# EAGLE design SystemControlCard (EAGLE 9.6.2)

## Sheet 1 of 2
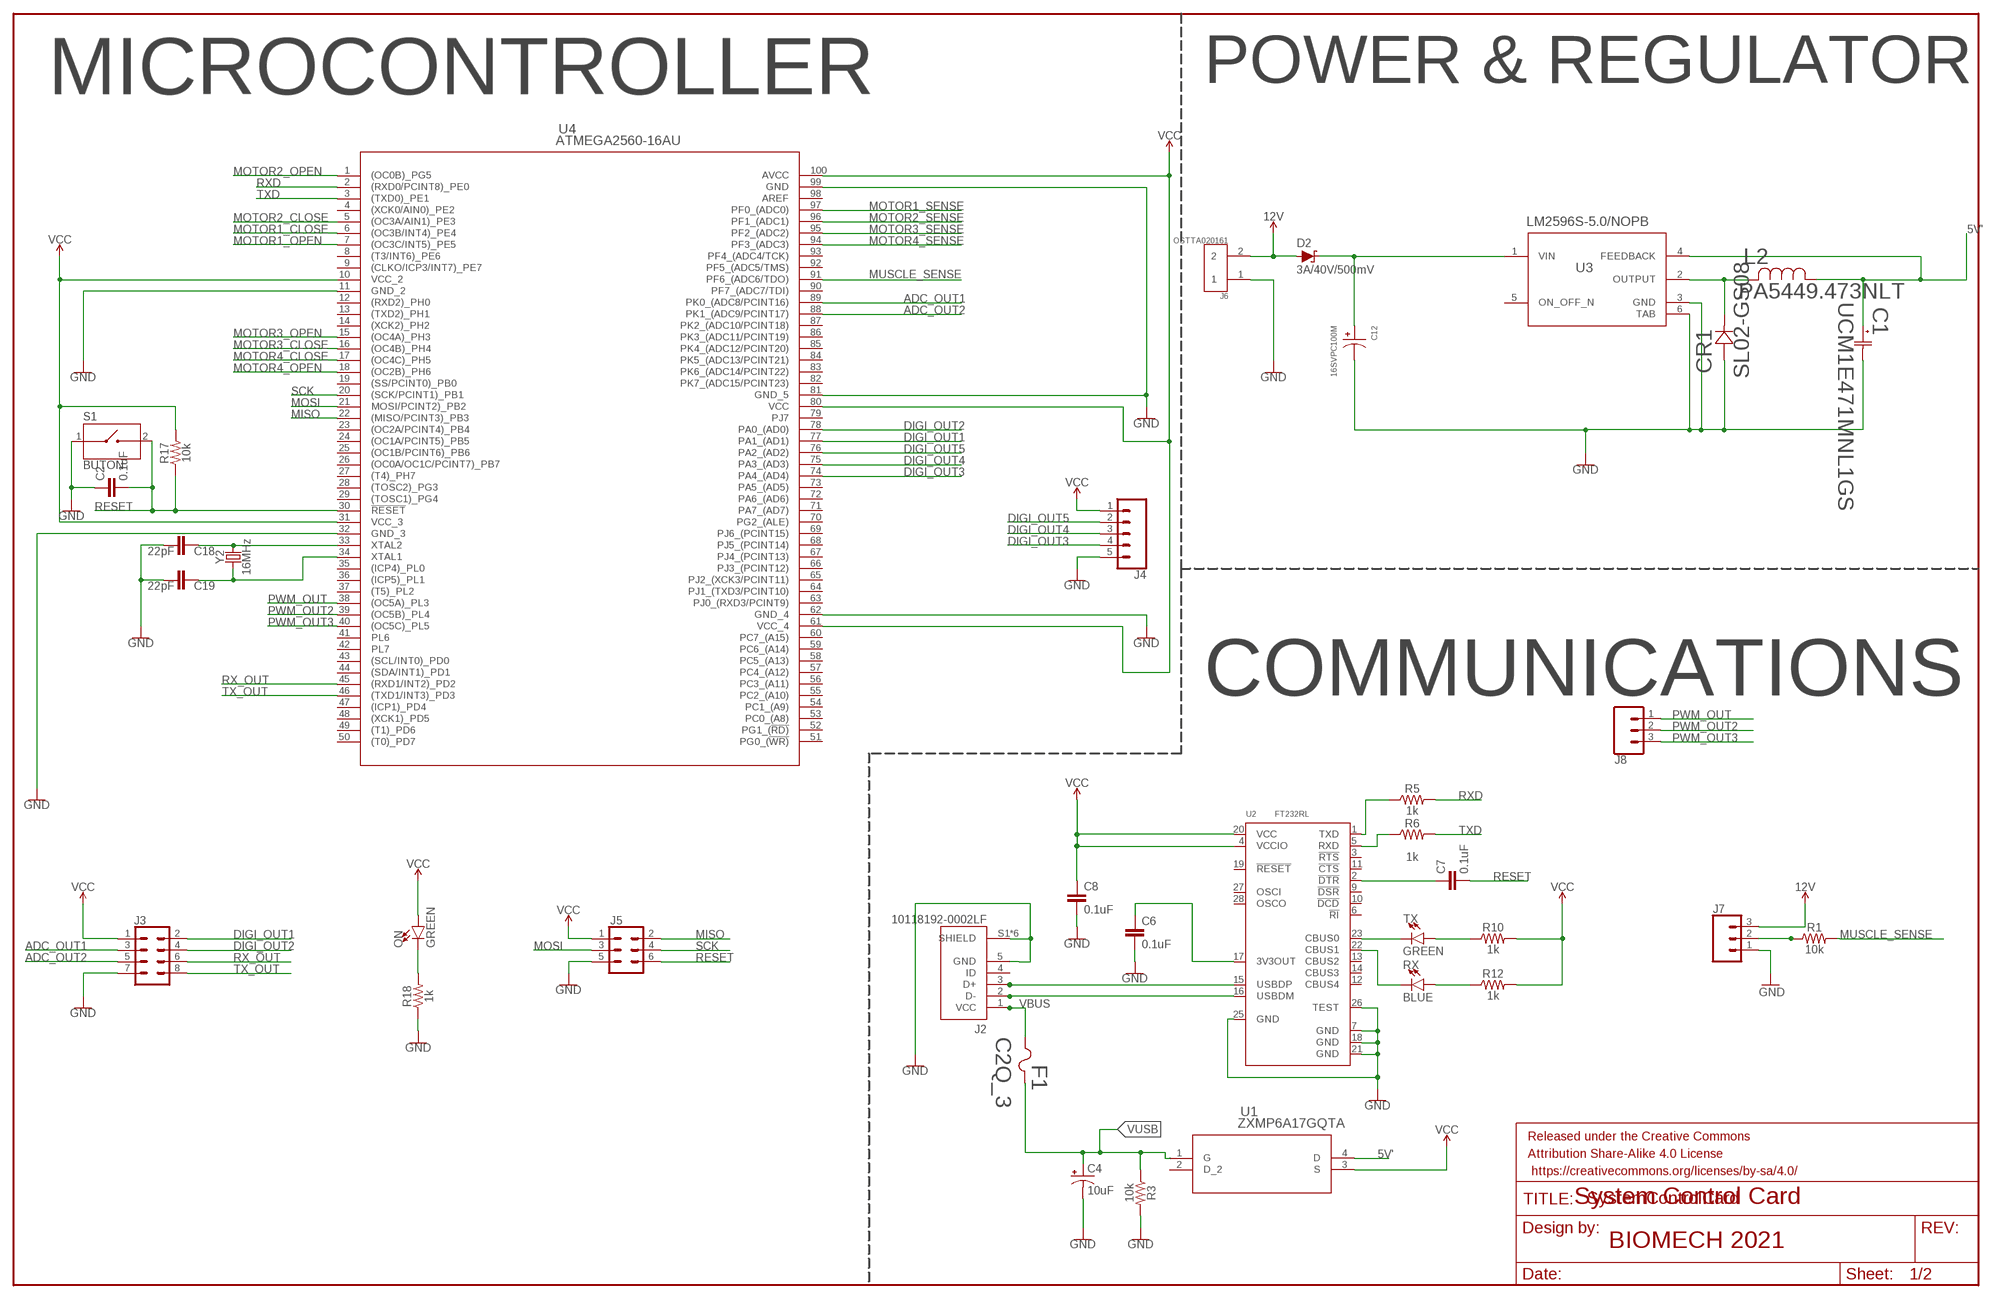
[diagram p0: schematic, sheet 1]

### Parts
C1  UCM1E471MNL1GS  [CAP_UCD_8X10_NCH]
C2  0.1uF  0.1UF-0603-25V-5%  [0603]
C4  10uF  10UF-POLAR-EIA3216-16V-10%(TANT)  [EIA3216]
C6  0.1uF  0.1UF-0603-25V-5%  [0603]
C7  0.1uF  0.1UF-0603-25V-5%  [0603]
C8  0.1uF  0.1UF-0603-25V-5%  [0603]
C12  16SVPC100M  [CAP_16SVPC100M]
C18  22pF  22PF-0603-50V-5%  [0603]
C19  22pF  22PF-0603-50V-5%  [0603]
CR1  SL02-GS08  [DIODE_SL02-GS08_VIS]
D2  3A/40V/500mV  DIODE-SCHOTTKY-B340A  [SMA-DIODE]
F1  C2Q_3  [C2_BEL]
FRAME2  FRAME-LEDGER  [CREATIVE_COMMONS]
J2  10118192-0002LF  [AMPHENOL_10118192-0002LF]
J3  CONN_04X2  [2X4]
J4  CONN_05NO_SILK  [1X05_NO_SILK]
J5  CONN_03X2NO_SILK  [2X3-NS]
J6  OSTTA020161  [OST_OSTTA020161]
J7  CONN_031X03_NO_SILK  [1X03_NO_SILK]
J8  CONN_031X03_NO_SILK  [1X03_NO_SILK]
L2  PA5449.473NLT  [IND_PA5449.473NLT_PUL]
ON  GREEN  LED-GREEN0603  [LED-0603]
R1  10k  10KOHM-0603-1/10W-1%  [0603]
R3  10k  10KOHM-0603-1/10W-1%  [0603]
R5  1k  1KOHM-0603-1/10W-1%  [0603]
R6  1k  1KOHM-0603-1/10W-1%  [0603]
R10  1k  1KOHM-0603-1/10W-1%  [0603]
R12  1k  1KOHM-0603-1/10W-1%  [0603]
R17  10k  10KOHM-0603-1/10W-1%  [0603]
R18  1k  1KOHM-0603-1/10W-1%  [0603]
RX  BLUE  LED-BLUE0603  [LED-0603]
S1  BUTON  1437566-4  [SW_1437566-4]
TX  GREEN  LED-GREEN0603  [LED-0603]
U1  ZXMP6A17GQTA  [SOT-223_DIO]
U2  FT232RL  INTERFACE-FT232RL(SSOP28)  [SSOP28-0.65-10.2X5.2MM]
U3  LM2596S-5.0/NOPB  [KTT0005B]
U4  ATMEGA2560-16AU  [100A_ATM]
Y2  16MHz  CRYSTAL-16MHZPTH-HC49US  [HC49US]

### Nets
5V': C1.1 L2.1 U1.4(D) U3.4(FEEDBACK)
12V: D2.A J6.2 J7.3 ; also sheet 2
ADC_OUT1: J3.3 U4.89(PK0_(ADC8/PCINT16))
ADC_OUT2: J3.5 U4.88(PK1_(ADC9/PCINT17))
DIGI_OUT1: J3.2 U4.77(PA1_(AD1))
DIGI_OUT2: J3.4 U4.78(PA0_(AD0))
DIGI_OUT3: J4.4 U4.74(PA4_(AD4))
DIGI_OUT4: J4.3 U4.75(PA3_(AD3))
DIGI_OUT5: J4.2 U4.76(PA2_(AD2))
GND: C1.2 C2.1 C4.- C6.2 C8.2 C12.2 C18.2 C19.2 CR1.2 J2.5(GND) J2.S1(SHIELD) J2.S2(SHIELD) J2.S3(SHIELD) J2.S4(SHIELD) J2.S5(SHIELD) J2.S6(SHIELD) J3.7 J4.5 J5.5 J6.1 J7.1 R3.2 R18.1 S1.1 U2.7(GND) U2.18(GND) U2.21(GND) U2.25(GND) U2.26(TEST) U3.3(GND) U3.6(TAB) U4.11(GND_2) U4.32(GND_3) U4.62(GND_4) U4.81(GND_5) U4.99(GND) ; also sheet 2
MISO: J5.2 U4.22((MISO/PCINT3)_PB3)
MOSI: J5.3 U4.21(MOSI/PCINT2)_PB2)
MOTOR1_CLOSE: U4.6((OC3B/INT4)_PE4) ; also sheet 2
MOTOR1_OPEN: U4.7((OC3C/INT5)_PE5) ; also sheet 2
MOTOR1_SENSE: U4.97(PF0_(ADC0)) ; also sheet 2
MOTOR2_CLOSE: U4.5((OC3A/AIN1)_PE3) ; also sheet 2
MOTOR2_OPEN: U4.1((OC0B)_PG5) ; also sheet 2
MOTOR2_SENSE: U4.96(PF1_(ADC1)) ; also sheet 2
MOTOR3_CLOSE: U4.16((OC4B)_PH4) ; also sheet 2
MOTOR3_OPEN: U4.15((OC4A)_PH3) ; also sheet 2
MOTOR3_SENSE: U4.95(PF2_(ADC2)) ; also sheet 2
MOTOR4_CLOSE: U4.17((OC4C)_PH5) ; also sheet 2
MOTOR4_OPEN: U4.18((OC2B)_PH6) ; also sheet 2
MOTOR4_SENSE: U4.94(PF3_(ADC3)) ; also sheet 2
MUSCLE_SENSE: R1.2 U4.91(PF6_(ADC6/TDO))
N$1: C12.1 D2.C U3.1(VIN)
N$2: J2.3(D+) U2.15(USBDP)
N$4: J2.2(D-) U2.16(USBDM)
N$5: R5.1 U2.1(TXD)
N$6: R6.1 U2.5(RXD)
N$7: C6.1 U2.17(3V3OUT)
N$9: TX.C U2.23(CBUS0)
N$10: RX.C U2.22(CBUS1)
N$11: J7.2 R1.1
N$12: R10.1 TX.A
N$13: R12.1 RX.A
N$14: C7.1 U2.2(!DTR)
N$18: CR1.1 L2.2 U3.2(OUTPUT)
N$40: ON.C R18.2
N$41: C18.1 U4.33(XTAL2) Y2.2
N$42: C19.1 U4.34(XTAL1) Y2.1
PWM_OUT: J8.1 U4.38((OC5A)_PL3)
PWM_OUT2: J8.2 U4.39((OC5B)_PL4)
PWM_OUT3: J8.3 U4.40((OC5C)_PL5)
RESET: C2.2 C7.2 J5.6 R17.1 S1.2 U4.30(!RESET)
RX_OUT: J3.6 U4.45((RXD1/INT2)_PD2)
RXD: R5.2 U4.2((RXD0/PCINT8)_PE0)
SCK: J5.4 U4.20((SCK/PCINT1)_PB1)
TX_OUT: J3.8 U4.46((TXD1/INT3)_PD3)
TXD: R6.2 U4.3((TXD0)_PE1)
VBUS: F1.1 J2.1(VCC)
VCC: C8.1 J3.1 J4.1 J5.1 ON.A R10.2 R12.2 R17.2 U1.3(S) U2.4(VCCIO) U2.20(VCC) U4.10(VCC_2) U4.31(VCC_3) U4.61(VCC_4) U4.80(VCC) U4.100(AVCC) ; also sheet 2
VUSB: C4.+ F1.2 R3.1 U1.1(G)
Unconnected: J2.4(ID) U1.2(D_2) U2.3(!RTS) U2.6(!RI) U2.9(!DSR) U2.10(!DCD) U2.11(!CTS) U2.12(CBUS4) U2.13(CBUS2) U2.14(CBUS3) U2.19(!RESET) U2.27(OSCI) U2.28(OSCO) U3.5(ON_OFF_N) U4.4((XCK0/AIN0)_PE2) U4.8((T3/INT6)_PE6) U4.9((CLKO/ICP3/INT7)_PE7) U4.12((RXD2)_PH0) U4.13((TXD2)_PH1) U4.14((XCK2)_PH2) U4.19((SS/PCINT0)_PB0) U4.23((OC2A/PCINT4)_PB4) U4.24((OC1A/PCINT5)_PB5) U4.25((OC1B/PCINT6)_PB6) U4.26((OC0A/OC1C/PCINT7)_PB7) U4.27((T4)_PH7) U4.28((TOSC2)_PG3) U4.29((TOSC1)_PG4) U4.35((ICP4)_PL0) U4.36((ICP5)_PL1) U4.37((T5)_PL2) U4.41(PL6) U4.42(PL7) U4.43((SCL/INT0)_PD0) U4.44((SDA/INT1)_PD1) U4.47((ICP1)_PD4) U4.48((XCK1)_PD5) U4.49((T1)_PD6) U4.50((T0)_PD7) U4.51(PG0_(!WR)) U4.52(PG1_(!RD)) U4.53(PC0_(A8)) U4.54(PC1_(A9)) U4.55(PC2_(A10)) U4.56(PC3_(A11)) U4.57(PC4_(A12)) U4.58(PC5_(A13)) U4.59(PC6_(A14)) U4.60(PC7_(A15)) U4.63(PJ0_(RXD3/PCINT9)) U4.64(PJ1_(TXD3/PCINT10)) U4.65(PJ2_(XCK3/PCINT11)) U4.66(PJ3_(PCINT12)) U4.67(PJ4_(PCINT13)) U4.68(PJ5_(PCINT14)) U4.69(PJ6_(PCINT15)) U4.70(PG2_(ALE)) U4.71(PA7_(AD7)) U4.72(PA6_(AD6)) U4.73(PA5_(AD5)) U4.79(PJ7) U4.82(PK7_(ADC15/PCINT23)) U4.83(PK6_(ADC14/PCINT22)) U4.84(PK5_(ADC13/PCINT21)) U4.85(PK4_(ADC12/PCINT20)) U4.86(PK3_(ADC11/PCINT19)) U4.87(PK2_(ADC10/PCINT18)) U4.90(PF7_(ADC7/TDI)) U4.92(PF5_(ADC5/TMS)) U4.93(PF4_(ADC4/TCK))

### Notes on the sheet
- MICROCONTROLLER | POWER & REGULATOR
- COMMUNICATIONS

## Sheet 2 of 2
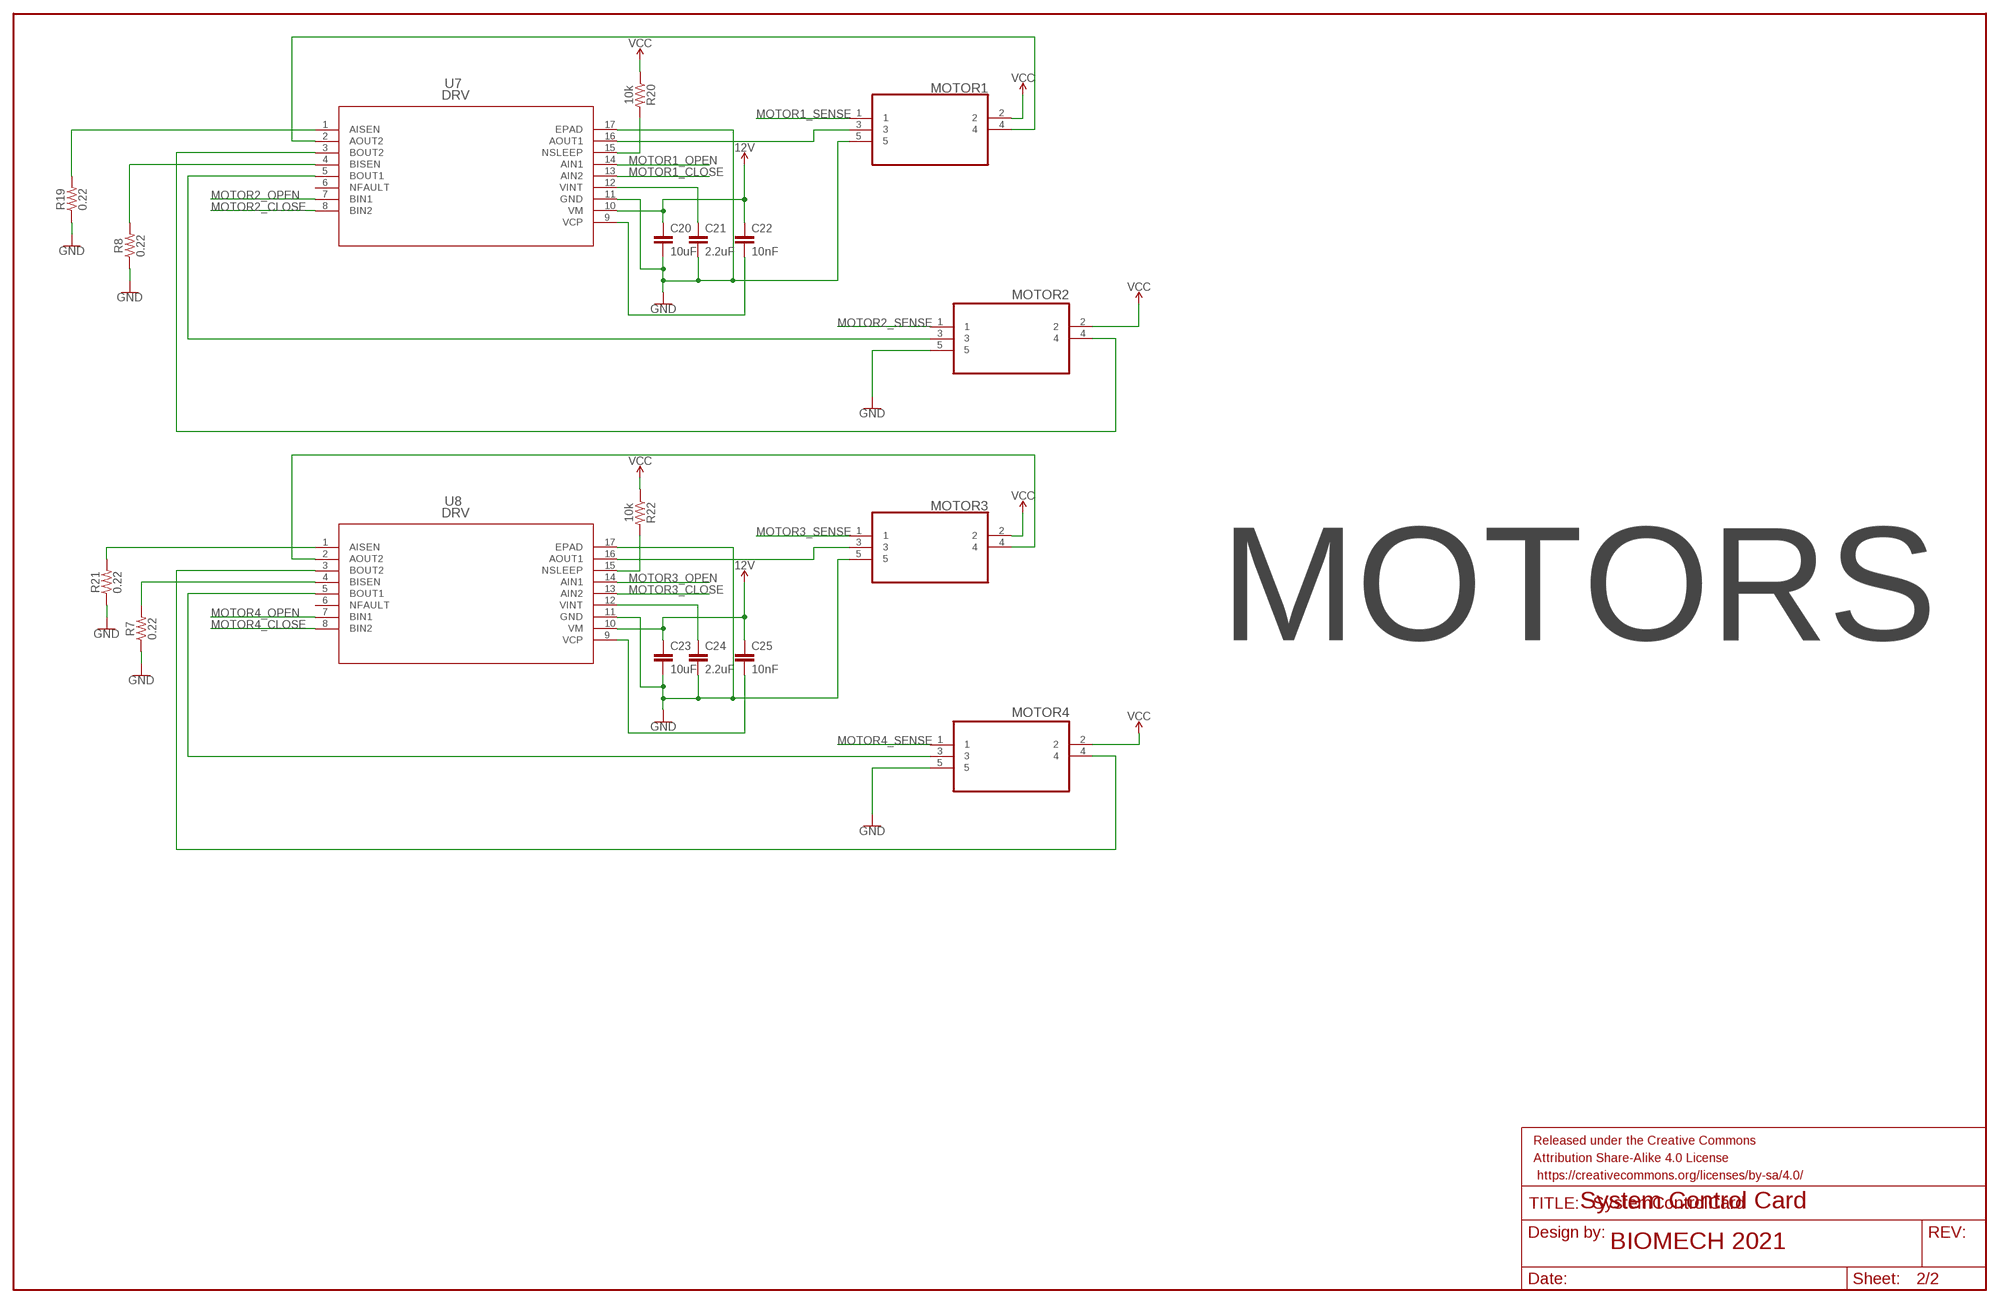
[diagram p1: schematic, sheet 2]

### Parts
C20  10uF  10UF-0603-6.3V-20%  [0603]
C21  2.2uF  2.2UF-0603-10V-20%  [0603]
C22  10nF  10NF-0603-50V-10%  [0603]
C23  10uF  10UF-0603-6.3V-20%  [0603]
C24  2.2uF  2.2UF-0603-10V-20%  [0603]
C25  10nF  10NF-0603-50V-10%  [0603]
FRAME1  FRAME-LEDGER  [CREATIVE_COMMONS]
MOTOR1  SFW5R-1STE1LF  [FCI_SFW5R-1STE1LF]
MOTOR2  SFW5R-1STE1LF  [FCI_SFW5R-1STE1LF]
MOTOR3  SFW5R-1STE1LF  [FCI_SFW5R-1STE1LF]
MOTOR4  SFW5R-1STE1LF  [FCI_SFW5R-1STE1LF]
R7  0.22  0.22OHM-0805-1/4W-1%  [0805]
R8  0.22  0.22OHM-0805-1/4W-1%  [0805]
R19  0.22  0.22OHM-0805-1/4W-1%  [0805]
R20  10k  10KOHM-0603-1/10W-1%  [0603]
R21  0.22  0.22OHM-0805-1/4W-1%  [0805]
R22  10k  10KOHM-0603-1/10W-1%  [0603]
U7  DRV  DRV8833RTYT  [RTY16]
U8  DRV  DRV8833RTYT  [RTY16]

### Nets
12V: C20.1 C22.1 C23.1 C25.1 U7.10(VM) U8.10(VM) ; also sheet 1
GND: C20.2 C21.2 C23.2 C24.2 MOTOR1.5 MOTOR2.5 MOTOR3.5 MOTOR4.5 R7.1 R8.1 R19.1 R21.1 U7.11(GND) U7.17(EPAD) U8.11(GND) U8.17(EPAD) ; also sheet 1
MOTOR1_CLOSE: U7.13(AIN2) ; also sheet 1
MOTOR1_OPEN: U7.14(AIN1) ; also sheet 1
MOTOR1_SENSE: MOTOR1.1 ; also sheet 1
MOTOR2_CLOSE: U7.8(BIN2) ; also sheet 1
MOTOR2_OPEN: U7.7(BIN1) ; also sheet 1
MOTOR2_SENSE: MOTOR2.1 ; also sheet 1
MOTOR3_CLOSE: U8.13(AIN2) ; also sheet 1
MOTOR3_OPEN: U8.14(AIN1) ; also sheet 1
MOTOR3_SENSE: MOTOR3.1 ; also sheet 1
MOTOR4_CLOSE: U8.8(BIN2) ; also sheet 1
MOTOR4_OPEN: U8.7(BIN1) ; also sheet 1
MOTOR4_SENSE: MOTOR4.1 ; also sheet 1
N$15: R7.2 U8.4(BISEN)
N$16: R8.2 U7.4(BISEN)
N$43: C22.2 U7.9(VCP)
N$44: R19.2 U7.1(AISEN)
N$45: C21.1 U7.12(VINT)
N$46: MOTOR2.3 U7.5(BOUT1)
N$47: MOTOR1.4 U7.2(AOUT2)
N$48: MOTOR2.4 U7.3(BOUT2)
N$49: MOTOR1.3 U7.16(AOUT1)
N$50: R20.2 U7.15(NSLEEP)
N$51: C25.2 U8.9(VCP)
N$52: R21.2 U8.1(AISEN)
N$53: C24.1 U8.12(VINT)
N$54: MOTOR4.3 U8.5(BOUT1)
N$55: MOTOR3.4 U8.2(AOUT2)
N$56: MOTOR4.4 U8.3(BOUT2)
N$57: MOTOR3.3 U8.16(AOUT1)
N$58: R22.2 U8.15(NSLEEP)
VCC: MOTOR1.2 MOTOR2.2 MOTOR3.2 MOTOR4.2 R20.1 R22.1 ; also sheet 1
Unconnected: U7.6(NFAULT) U8.6(NFAULT)

### Notes on the sheet
- MOTORS

## Power pins joined to a net without a drawn wire
AREF: U4.98(AREF)

## Library data of the parts
C1 = ucm-yenıkapasıtor:UCM1E471MNL1GS; COPYRIGHT: Copyright (C) 2021 Ultra Librarian. All rights reserved.; MANUFACTURER_PART_NUMBER: UCM1E471MNL1GS; MFR_NAME: Nichicon
C2 C6-C8 = SparkFun-Capacitors:0.1UF: 0.1µF ceramic capacitors A capacitor is a passive two-terminal electrical component used to store electrical energy temporarily in an electric field.; PROD_ID: CAP-08604
C4 = SparkFun-Capacitors:10UF-POLAR: 10.0µF polarized capacitors A capacitor is a passive two-terminal electrical component used to store electrical energy temporarily in an electric field.; PROD_ID: CAP-00811
C12 = 16SVPC100M:16SVPC100M: Check prices <https://pricing.snapeda.com/parts/16SVPC100M/Panasonic/view-part?ref=eda>; AVAILABILITY: In Stock; DESCRIPTION: 100µF 16V Aluminum - Polymer Capacitors Radial, Can - SMD 24mOhm 2000 Hrs @ 105°C; MF: Panasonic; MP: 16SVPC100M; PACKAGE: RADIAL-2 Panasonic; PRICE: None; PURCHASE-URL: https://pricing.snapeda.com/search/part/16SVPC100M/?ref=eda
C18 C19 = SparkFun-Capacitors:22PF: 22pF ceramic capacitors A capacitor is a passive two-terminal electrical component used to store electrical energy temporarily in an electric field.; PROD_ID: CAP-07876
C20 C23 = SparkFun-Capacitors:10UF: 10.0µF ceramic capacitors A capacitor is a passive two-terminal electrical component used to store electrical energy temporarily in an electric field.; PROD_ID: CAP-11015
C21 C24 = SparkFun-Capacitors:2.2UF: 2.2µF ceramic capacitors A capacitor is a passive two-terminal electrical component used to store electrical energy temporarily in an electric field.; PROD_ID: CAP-07888
C22 C25 = SparkFun-Capacitors:10NF: 0.01uF/10nF/10,000pF ceramic capacitors A capacitor is a passive two-terminal electrical component used to store electrical energy temporarily in an electric field. CAP-09321; PROD_ID: CAP-00867
CR1 = sl02 diodes:SL02-GS08; COPYRIGHT: Copyright (C) 2021 Ultra Librarian. All rights reserved.; MANUFACTURER_PART_NUMBER: SL02-GS08; MFR_NAME: Vishay
D2 = SparkFun-DiscreteSemi:DIODE-SCHOTTKY: Schottky diode A Schottky diode is a semiconductor diode which has a low forward voltage drop and a very fast switching action.; PROD_ID: DIO-09886
F1 = sigorta 603 paket:C2Q_3; COPYRIGHT: Copyright (C) 2021 Ultra Librarian. All rights reserved.; DIGI-KEY_PART_NUMBER_1: 507-1096-1-ND; DIGI-KEY_PART_NUMBER_2: 507-1096-2-ND; DIGI-KEY_PART_NUMBER_3: 507-1096-6-ND; MANUFACTURER_PART_NUMBER: C2Q 3; MFR_NAME: Belfuse
FRAME1 FRAME2 = SparkFun-Aesthetics:FRAME-LEDGER: Schematic Frame - Ledger Standard 11x14 US Ledger frame; DESIGNED_BY: BIOMECH 2021; TITLE: System Control Card
J2 = 10118192-0002LF:10118192-0002LF: USB - micro B USB 2.0 Receptacle Connector 5 Position Surface Mount, Right Angle Check prices <https://pricing.snapeda.com/parts/10118192-0002LF/Amphenol%20ICC/view-part?ref=eda>; AVAILABILITY: In Stock; DESCRIPTION: USB - micro B USB 2.0 Receptacle Connector 5 Position Surface Mount, Right Angle; MF: Amphenol ICC; MP: 10118192-0002LF; PACKAGE: None; PRICE: None; PURCHASE-URL: https://pricing.snapeda.com/search/part/10118192-0002LF/?ref=eda
J3 = SparkFun-Connectors:CONN_04X2: Multi connection point. Often used as Generic Header-pin footprint for 0.1 inch spaced/style header connections On any of the 0.1 inch spaced packages, you can populate with these: Break Away Headers - Straight <https://www.sparkfun.com/products/116> (PRT-00116) Break Away Male Headers - Right Angle <https://www.sparkfun.com/products/553> (PRT-00553) Female Headers <https://www.sparkfun.com/products/115> (PRT-00115) Break Away Headers - Machine Pin <https://www.sparkfun.com/products/117> (PRT-00117) Break Away Female Headers - Swiss Machine Pin <https://www.sparkfun.com/products/743> (PRT-00743)
J4 = SparkFun-Connectors:CONN_05: Multi connection point. Often used as Generic Header-pin footprint for 0.1 inch spaced/style header connections On any of the 0.1 inch spaced packages, you can populate with these: Break Away Headers - Straight <https://www.sparkfun.com/products/116> (PRT-00116) Break Away Male Headers - Right Angle <https://www.sparkfun.com/products/553> (PRT-00553) Female Headers <https://www.sparkfun.com/products/115> (PRT-00115) Break Away Headers - Machine Pin <https://www.sparkfun.com/products/117> (PRT-00117) Break Away Female Headers - Swiss Machine Pin <https://www.sparkfun.com/products/743> (PRT-00743) For SCREWTERMINALS and SPRING TERMINALS visit here: Screw Terimnals on SparkFun.com <https://www.sparkfun.com/search/results?term=Screw+Terminals> (5mm/3.5mm/2.54mm spacing) This device is also useful as a general connection point to wire up your design to another part of your project. Our various solder wires solder well into these plated through hole pads. Hook-Up Wire - Assortment (Stranded, 22 AWG) <https://www.sparkfun.com/products/11375> (PRT-11375) Hook-Up Wire - Assortment (Solid Core, 22 AWG) <https://www.sparkfun.com/products/11367> (PRT-11367) View the entire wire category on our website here <https://www.sparkfun.com/categories/141> Special notes: Molex polarized connector foot print use with SKU : PRT-08231 with associated crimp pins and housings. 1MM SMD Version SKU: PRT-10208
J5 = SparkFun-Connectors:CONN_03X2: Multi connection point. Often used as Generic Header-pin footprint for 0.1 inch spaced/style header connections You can populate with any combo of single row headers, but if you'd like an exact match, check these: Header - 2x3 (Male, 0.1") <https://www.sparkfun.com/products/12807> (PRT-12807) Header - 2x3 (Female, 0.1") <https://www.sparkfun.com/products/13010> (PRT-13010) 2x3 Pin Shrouded Header <https://www.sparkfun.com/products/10877> (PRT-10877) On any of the 0.1 inch spaced packages, you can populate with these: Break Away Headers - Straight <https://www.sparkfun.com/products/116> (PRT-00116) Break Away Male Headers - Right Angle <https://www.sparkfun.com/products/553> (PRT-00553) Female Headers <https://www.sparkfun.com/products/115> (PRT-00115) Break Away Headers - Machine Pin <https://www.sparkfun.com/products/117> (PRT-00117) Break Away Female Headers - Swiss Machine Pin <https://www.sparkfun.com/products/743> (PRT-00743) Special note: the shrouded connector mates well with our 3x2 ribbon cables: Ribbon Crimp Connector - 6-pin (2x3, Female) <https://www.sparkfun.com/products/10651> (PRT-10651) Ribbon Cable - 6 wire (15ft) <https://www.sparkfun.com/products/10646> (PRT-10646)
J6 = OSTTA020161:OSTTA020161: Connector Terminal Blocks 2 Position 5mm Solder Straight Thru-Hole 16A Check prices <https://pricing.snapeda.com/parts/OSTTA020161/On%20Shore%20Technology%20Inc./view-part?ref=eda>; AVAILABILITY: In Stock; DESCRIPTION: 2 Position Wire to Board Terminal Block Horizontal with Board 0.197 (5.00mm) Through Hole; MF: On Shore Technology Inc.; MP: OSTTA020161; PACKAGE: None; PRICE: None; PURCHASE-URL: https://pricing.snapeda.com/search/part/OSTTA020161/?ref=eda
J7 J8 = SparkFun-Connectors:CONN_03: Multi connection point. Often used as Generic Header-pin footprint for 0.1 inch spaced/style header connections On any of the 0.1 inch spaced packages, you can populate with these: Break Away Headers - Straight <https://www.sparkfun.com/products/116> (PRT-00116) Break Away Male Headers - Right Angle <https://www.sparkfun.com/products/553> (PRT-00553) Female Headers <https://www.sparkfun.com/products/115> (PRT-00115) Break Away Headers - Machine Pin <https://www.sparkfun.com/products/117> (PRT-00117) Break Away Female Headers - Swiss Machine Pin <https://www.sparkfun.com/products/743> (PRT-00743) Stackable Header - 3 Pin (Female, 0.1") <https://www.sparkfun.com/products/13875> (PRT-13875) For SCREWTERMINALS and SPRING TERMINALS visit here: Screw Terimnals on SparkFun.com <https://www.sparkfun.com/search/results?term=Screw+Terminals> (5mm/3.5mm/2.54mm spacing) This device is also useful as a general connection point to wire up your design to another part of your project. Our various solder wires solder well into these plated through hole pads. Hook-Up Wire - Assortment (Stranded, 22 AWG) <https://www.sparkfun.com/products/11375> (PRT-11375) Hook-Up Wire - Assortment (Solid Core, 22 AWG) <https://www.sparkfun.com/products/11367> (PRT-11367) View the entire wire category on our website here <https://www.sparkfun.com/categories/141> Special notes: Molex polarized connector foot print use with SKU : PRT-08232 with associated crimp pins and housings.
L2 = PA5449-INDUCTOR:PA5449.473NLT; COPYRIGHT: Copyright (C) 2021 Ultra Librarian. All rights reserved.; MANUFACTURER_PART_NUMBER: PA5449.473NLT; MFR_NAME: Pulse Electronics Corporation
MOTOR1-MOTOR4 = SFW5R-1STE1LF:SFW5R-1STE1LF: FFC/FPC CONNECTOR, RECEPTACLE, 5POS 1ROW Check prices <https://pricing.snapeda.com/parts/SFW5R-1STE1LF/Amphenol%20ICC/view-part?ref=eda>; AVAILABILITY: In Stock; DESCRIPTION: 5 Position FFC, FPC Connector Contacts, Bottom 0.039 (1.00mm) Surface Mount, Right Angle; MF: Amphenol ICC; MP: SFW5R-1STE1LF; PACKAGE: None; PRICE: None
ON TX = SparkFun-LED:LED-GREEN: Green SMD LED Used in manufacturing of various products at SparkFun Packages: 0603 - SMD 0603 package [Product Link] <http://www.futureelectronics.com/en/technologies/semiconductors/optoelectronics/leds/Pages/9894312-LTST-C190GKT.aspx?CrossPart=HSMG-C190&IM=0> LilyPad 1206 - SMD1206 LilyPad package [Product Link] <http://www.futureelectronics.com/en/Technologies/Product.aspx?ProductID=IN150NGHARVATEKCORPORATION2049943&IM=0> 1206 - SMD1206 package [Product Link] <http://www.futureelectronics.com/en/technologies/semiconductors/optoelectronics/leds/Pages/8315665-LTST-C150KGKT.aspx?IM=0> 1206 Bottom Mount -SMD 1206 Bottom Mount [Product Link] <http://www.digikey.com/product-detail/en/lite-on-inc/LTST-C230KGKT/160-1456-1-ND/386854> SparkFun Products: Pro Mini 328 -5V <https://www.sparkfun.com/products/821> RedBoard <https://www.sparkfun.com/products/12757> MP3 Trigger <https://www.sparkfun.com/products/13720> Makey Makey <https://www.sparkfun.com/products/11076>; PROD_ID: DIO-00821
R1 R3 R17 R20 R22 = SparkFun-Resistors:10KOHM: 10kΩ resistor A resistor is a passive two-terminal electrical component that implements electrical resistance as a circuit element. Resistors act to reduce current flow, and, at the same time, act to lower voltage levels within circuits. - Wikipedia; PROD_ID: RES-00824
R5 R6 R10 R12 R18 = SparkFun-Resistors:1KOHM: 1kΩ resistor A resistor is a passive two-terminal electrical component that implements electrical resistance as a circuit element. Resistors act to reduce current flow, and, at the same time, act to lower voltage levels within circuits. - Wikipedia; PROD_ID: RES-07856
R7 R8 R19 R21 = SparkFun-Resistors:0.22OHM: 0.22Ω resistor A resistor is a passive two-terminal electrical component that implements electrical resistance as a circuit element. Resistors act to reduce current flow, and, at the same time, act to lower voltage levels within circuits. - Wikipedia; PROD_ID: RES-09883
RX = SparkFun-LED:LED-BLUE: Blue SMD LED Used in manufacturing of various products at SparkFun Packages: 0603 - SMD 0603 package [Product Link] <http://www.digikey.com/product-detail/en/SMLE12BC7TT86/511-1589-2-ND/1641808> 1206 - SMD1206 package [Product Link] <http://www.digikey.com/product-detail/en/lite-on-inc/LTST-C150TBKT/160-1643-1-ND/573584> SparkFun Products: ESP8266 Thing-Dev Board <https://www.sparkfun.com/products/13711> RedBoard <https://www.sparkfun.com/products/12757>; PROD_ID: DIO-08575
S1 = 1437566-4:1437566-4: SWITCH TACTILE SPST-NO 0.05A 24V Check prices <https://pricing.snapeda.com/parts/FSMSMTR/TE%20Connectivity/view-part?ref=eda>; AVAILABILITY: In Stock; COMMENT: 1437566-4; CONFIGURATION_POLE-THROW: Single Pole - Single Throw; CONTACT_CURRENT_RATING: 50 mA; DESCRIPTION: Switch Tactile OFF (ON) SPST Rectangular Button Gull Wing 0.05A 12VDC 1.77N SMD T/R; MF: TE Connectivity; MP: FSMSMTR; PACKAGE: None; PRICE: None; PURCHASE-URL: https://pricing.snapeda.com/search/part/FSMSMTR/?ref=eda
U1 = mosfet:ZXMP6A17GQTA; COPYRIGHT: Copyright (C) 2021 Ultra Librarian. All rights reserved.; DIGI-KEY_PART_NUMBER_1: ZXMP6A17GQTADICT-ND; DIGI-KEY_PART_NUMBER_2: ZXMP6A17GQTADIDKR-ND; DIGI-KEY_PART_NUMBER_3: ZXMP6A17GQTADITR-ND; MANUFACTURER_PART_NUMBER: ZXMP6A17GQTA; MFR_NAME: Diodes Inc
U2 = INTERFACE-FT232RL_SSOP28_:INTERFACE-FT232RL(SSOP28): 310070022 Check prices <https://pricing.snapeda.com/parts/FT232RL/FTDI%2C%20Future/view-part?ref=eda>; AVAILABILITY: No availability data; DESCRIPTION: USB Bridge, USB to UART USB 2.0 UART Interface 28-SSOP; MF: FTDI, Future; MP: FT232RL; PACKAGE: SSOP-28 FTDI; PRICE: None
U3 = lm2596s-5v:LM2596S-5.0/NOPB; COPYRIGHT: Copyright (C) 2021 Ultra Librarian. All rights reserved.; MANUFACTURER_PART_NUMBER: LM2596S-5.0/NOPB; MFR_NAME: Texas Instruments; REFDES: RefDes; TYPE: TYPE
U4 = ATMEGA 2560:ATMEGA2560-16AU; BUILT_BY: EMA_UL_Team; MANUFACTURER_PART_NUMBER: ATMEGA2560-16AU; SOURCELIBRARY: Atmel_2011-04-02; VENDOR: Atmel
U7 U8 = DRV8833:DRV8833RTYT; DATASHEET_URL: http://www.ti.com/lit/gpn/DRV8833; DESCRIPTION: 2A Low Voltage Dual Brushed DC or Single Bipolar Stepper Motor Driver (PWM Ctrl); FAMILY_NAME: BRUSHED DC DRIVER; GENERIC_PART_NUMBER: DRV8833; INDUSTRY_STD_PKG_TYPE: QFN; MANUFACTURER: Texas Instruments; MANUFACTURER_PART_NUMBER: DRV8833RTYT; PACKAGE_DESIGNATOR: RTY; PIN_COUNT: 16; VENDOR: Texas Instruments
Y2 = SparkFun-Clocks:CRYSTAL-16MHZ: 16MHz Crystal Digikey Example <http://www.digikey.com/product-search/en?keywords=535-9122-1-ND> Frequency: 16MHz Frequency Stability: ±50ppm Frequency Tolerance: ±20ppm Load Capacitance: 18pF SparkFun Products: Pro Micro -5V/16MHz <https://www.sparkfun.com/products/12640> SparkFun Serial Enabled LCD Kit <https://www.sparkfun.com/products/10097>; PROD_ID: XTAL-08181; SF_ID: COM-00536

## Board
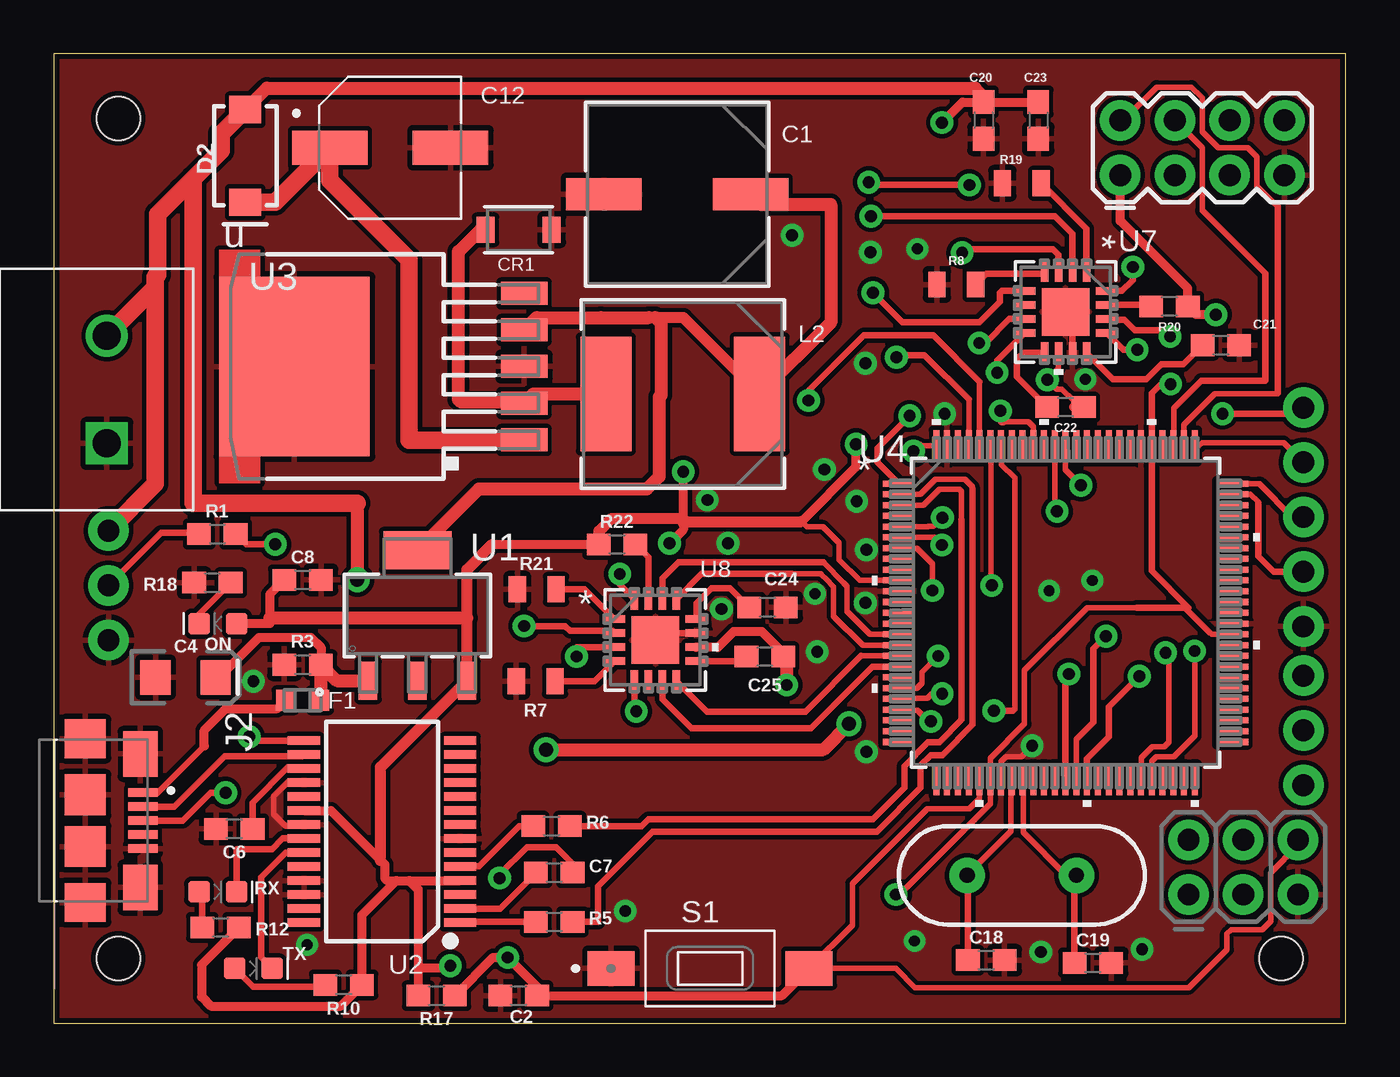
[diagram p2: board, top side]
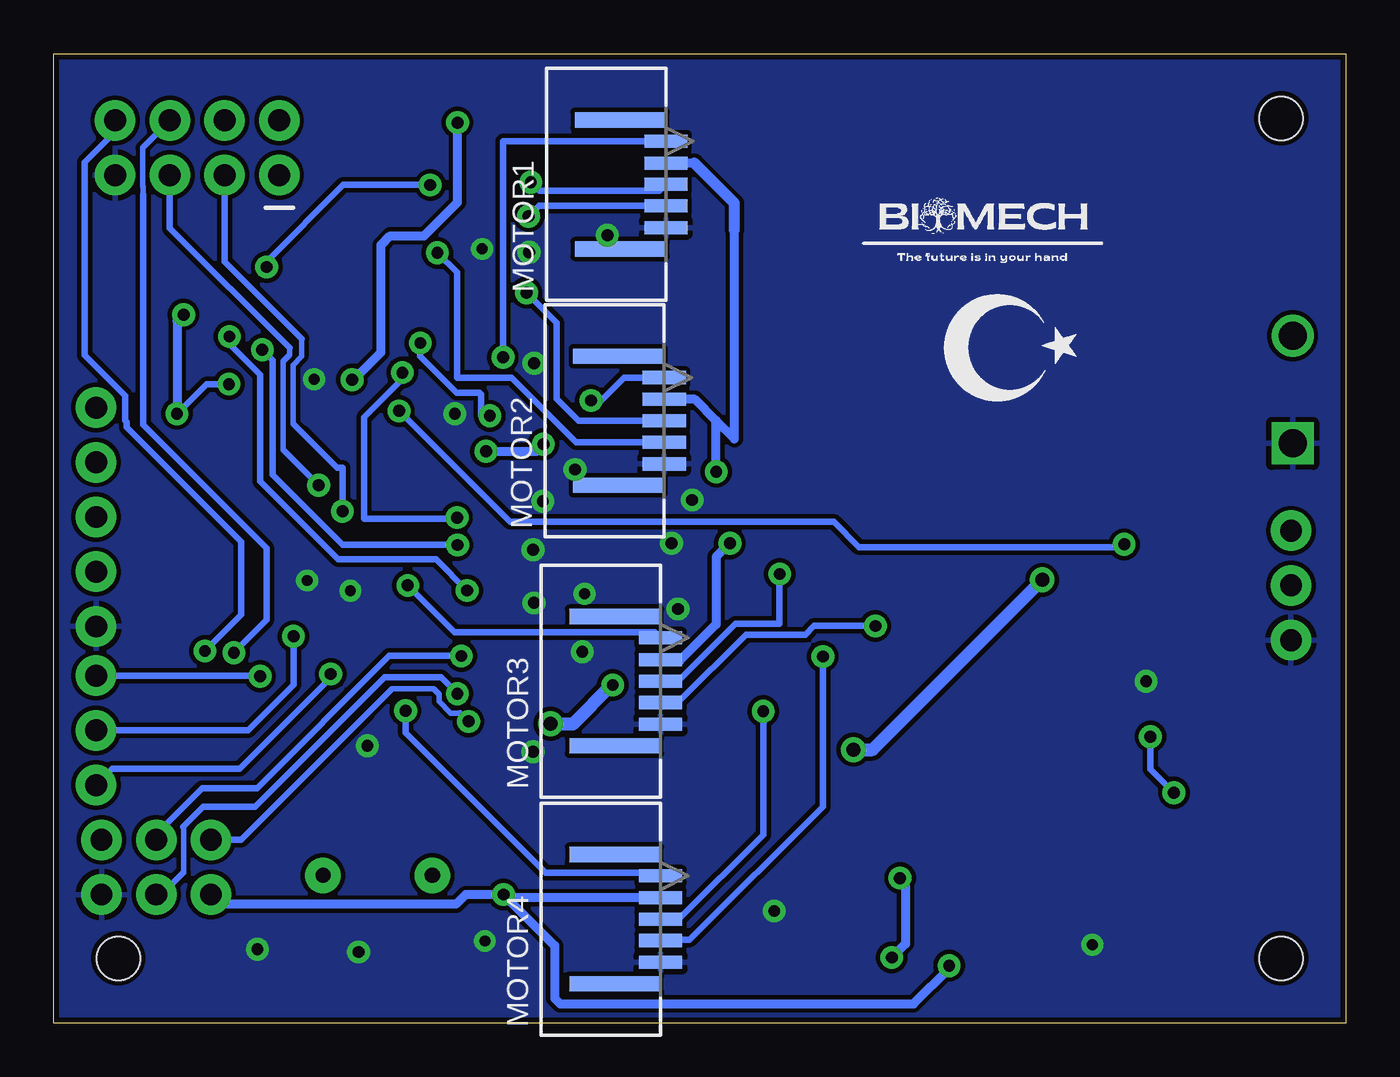
[diagram p3: board, bottom side, seen from below]

Size 60 x 45 mm. Coordinates in mm from the lower left corner, seen from the top.
Outline: 0,0 60,0 60,45 0,45 0,0
Copper layers (1*16): Top 0.035mm / dielectric 1.5mm / Bottom 0.035mm
Design rules "SparkFun_1": minimum track width 8mil, minimum drill 20mil, track to track 8mil, track to pad 8mil, pad to pad 8mil, via to via 8mil, smd to smd 8mil, copper to edge 10mil, drill to drill 8mil, minimum pad ring 12mil, minimum via ring 10mil, stop-mask expansion 4mil, vias tented up to drill 25mil, thermal gap 10mil
Holes 2 mm at 3,42 3,3 57,3

### Footprints (pad centres in the part's own frame; a part is rotated, then mirrored left to right if it is on the bottom)
CAP_UCD_8X10_NCH = smd 3.505 x 1.499: 1 -3.404,0; 2 3.404,0
0603 = smd 1.1 x 1: 1 -0.85,0; 2 0.85,0
EIA3216 = smd 1.4 x 1.6: + 1.4,0; - -1.4,0
CAP_16SVPC100M = smd 3.5 x 1.6: 1 -2.8,0; 2 2.8,0
DIODE_SL02-GS08_VIS = smd 0.838 x 1.194: 1 -1.537,0; 2 1.537,0
SMA-DIODE = smd 1.27 x 1.47: A -2.15,0; C 2.15,0
C2_BEL = smd 0.864 x 0.965: 1 -0.8,0; 2 0.8,0
AMPHENOL_10118192-0002LF = smd 0.4 x 1.35: 1 -1.3,0; 2 -0.65,0; 3 0,0; 4 0.65,0; 5 1.3,0 | smd 2.1 x 1.6: S1 -3.1,-0.125; S2 3.1,-0.125 | smd 1.8 x 1.9: S3 -3.8,-2.675; S6 3.8,-2.675 | smd 1.9 x 1.9: S4 -1.2,-2.675; S5 1.2,-2.675
2X4 = drill 1.016 pad 1.88: 1 -3.81,-1.27; 2 -3.81,1.27; 3 -1.27,-1.27; 4 -1.27,1.27; 5 1.27,-1.27; 6 1.27,1.27; 7 3.81,-1.27; 8 3.81,1.27
1X05_NO_SILK = drill 1.016 pad 1.88: 1 0,0; 2 2.54,0; 3 5.08,0; 4 7.62,0; 5 10.16,0
2X3-NS = drill 1.016 pad 1.88: 1 -2.54,-1.27; 2 -2.54,1.27; 3 0,-1.27; 4 0,1.27; 5 2.54,-1.27; 6 2.54,1.27
OST_OSTTA020161 = drill 1.3 square: 1 -2.5,0 | drill 1.3: 2 2.5,0
1X03_NO_SILK = drill 1.016 pad 1.88: 1 0,0; 2 2.54,0; 3 5.08,0
IND_PA5449.473NLT_PUL = smd 2.362 x 5.309: 1 -3.569,0; 2 3.569,0
FCI_SFW5R-1STE1LF = smd 0.61 x 2.007: 1 2.007,2.743; 2 0.991,2.743; 3 0,2.743; 4 -0.991,2.743; 5 -2.007,2.743 | smd 0.711 x 4.191: 6 -2.997,4.877; 7 2.997,4.877
LED-0603 = smd 1 x 1: A -0.877,0; C 0.877,0
0805 = smd 0.8 x 1.2: 1 -0.9,0; 2 0.9,0
SW_1437566-4 = smd 2.18 x 1.6: 1 -4.6,0; 2 4.6,0
SOT-223_DIO = smd 0.851 x 1.761: 1 -2.3,-3.025; 2 0,-3.025; 3 2.3,-3.025 | smd 3.151 x 1.761: 4 0,3.025
SSOP28-0.65-10.2X5.2MM = smd 0.4 x 1.5: 1 -4.225,-3.625; 2 -3.575,-3.625; 3 -2.925,-3.625; 4 -2.275,-3.625; 5 -1.625,-3.625; 6 -0.975,-3.625; 7 -0.325,-3.625; 8 0.325,-3.625; 9 0.975,-3.625; 10 1.625,-3.625; 11 2.275,-3.625; 12 2.925,-3.625; 13 3.575,-3.625; 14 4.225,-3.625; 15 4.225,3.625; 16 3.575,3.625; 17 2.925,3.625; 18 2.275,3.625; 19 1.625,3.625; 20 0.975,3.625; 21 0.325,3.625; 22 -0.325,3.625; 23 -0.975,3.625; 24 -1.625,3.625; 25 -2.275,3.625; 26 -2.925,3.625; 27 -3.575,3.625; 28 -4.225,3.625
KTT0005B = smd 2.16 x 1.07: 1 5.338,-3.4; 2 5.338,-1.7; 3 5.338,0.005; 4 5.338,1.7; 5 5.338,3.4 | smd 6.99 x 8.33: 6 -5.338,0
100A_ATM = smd 1.473 x 0.279: 1 -7.747,6; 2 -7.747,5.5; 3 -7.747,5; 4 -7.747,4.5; 5 -7.747,4; 6 -7.747,3.5; 7 -7.747,3; 8 -7.747,2.5; 9 -7.747,2; 10 -7.747,1.5; 11 -7.747,1; 12 -7.747,0.5; 13 -7.747,0; 14 -7.747,-0.5; 15 -7.747,-1; 16 -7.747,-1.5; 17 -7.747,-2; 18 -7.747,-2.5; 19 -7.747,-3; 20 -7.747,-3.5; 21 -7.747,-4; 22 -7.747,-4.5; 23 -7.747,-5; 24 -7.747,-5.5; 25 -7.747,-6; 51 7.747,-6; 52 7.747,-5.5; 53 7.747,-5; 54 7.747,-4.5; 55 7.747,-4; 56 7.747,-3.5; 57 7.747,-3; 58 7.747,-2.5; 59 7.747,-2; 60 7.747,-1.5; 61 7.747,-1; 62 7.747,-0.5; 63 7.747,0; 64 7.747,0.5; 65 7.747,1; 66 7.747,1.5; 67 7.747,2; 68 7.747,2.5; 69 7.747,3; 70 7.747,3.5; 71 7.747,4; 72 7.747,4.5; 73 7.747,5; 74 7.747,5.5; 75 7.747,6 | smd 0.279 x 1.473: 26 -6,-7.747; 27 -5.5,-7.747; 28 -5,-7.747; 29 -4.5,-7.747; 30 -4,-7.747; 31 -3.5,-7.747; 32 -3,-7.747; 33 -2.5,-7.747; 34 -2,-7.747; 35 -1.5,-7.747; 36 -1,-7.747; 37 -0.5,-7.747; 38 0,-7.747; 39 0.5,-7.747; 40 1,-7.747; 41 1.5,-7.747; 42 2,-7.747; 43 2.5,-7.747; 44 3,-7.747; 45 3.5,-7.747; 46 4,-7.747; 47 4.5,-7.747; 48 5,-7.747; 49 5.5,-7.747; 50 6,-7.747; 76 6,7.747; 77 5.5,7.747; 78 5,7.747; 79 4.5,7.747; 80 4,7.747; 81 3.5,7.747; 82 3,7.747; 83 2.5,7.747; 84 2,7.747; 85 1.5,7.747; 86 1,7.747; 87 0.5,7.747; 88 0,7.747; 89 -0.5,7.747; 90 -1,7.747; 91 -1.5,7.747; 92 -2,7.747; 93 -2.5,7.747; 94 -3,7.747; 95 -3.5,7.747; 96 -4,7.747; 97 -4.5,7.747; 98 -5,7.747; 99 -5.5,7.747; 100 -6,7.747
RTY16 = smd 1 x 0.35: 1 -1.9,0.975; 2 -1.9,0.325; 3 -1.9,-0.325; 4 -1.9,-0.975; 9 1.9,-0.975; 10 1.9,-0.325; 11 1.9,0.325; 12 1.9,0.975 | smd 0.35 x 1: 5 -0.975,-1.9; 6 -0.325,-1.9; 7 0.325,-1.9; 8 0.975,-1.9; 13 0.975,1.9; 14 0.325,1.9; 15 -0.325,1.9; 16 -0.975,1.9 | smd 2.2 x 2.2: 17 0,0 | smd 0.3 x 0.3: V -0.394,-0.394
HC49US = drill 0.7 pad 1.651: 1 -2.54,0; 2 2.54,0

### Placement (x,y rotation side)
C1  28.96,38.48 180 top
C2  21.59,1.27 0 top
C4  6.12,16.05 0 top
C6  8.38,9.02 180 top
C7  23.24,6.99 0 top
C8  11.56,20.57 0 top
C12  15.62,40.64 0 top
C18  43.31,2.92 0 top
C19  48.26,2.79 0 top
C20  43.18,41.91 270 top
C21  54.2,31.47 0 top
C22  46.99,28.6 180 top
C23  45.72,41.91 270 top
C24  33.15,19.3 0 top
C25  33.02,17.02 180 top
CR1  21.59,36.83 0 top
D2  8.89,40.26 270 top
F1  11.56,14.99 0 top
FRAME1  -80.01,67.31 0 top  (outside the outline)
FRAME2  -80.01,76.2 0 top  (outside the outline)
J2  4.14,9.4 270 top
J3  53.34,40.64 0 top
J4  58.04,28.57 270 top
J5  55.24,7.24 0 top
J6  2.46,29.41 90 top
J7  2.54,17.78 90 top
J8  58.04,11.05 90 top
L2  29.21,29.21 180 top
MOTOR1  28.83,38.94 90 bottom
MOTOR2  28.91,27.97 90 bottom
MOTOR3  29.08,15.88 90 bottom
MOTOR4  29.08,4.83 90 bottom
ON  7.62,18.54 180 top
R1  7.59,22.71 0 top
R3  11.56,16.64 180 top
R5  23.24,4.7 0 top
R6  23.11,9.14 0 top
R7  22.38,15.88 0 top
R8  41.91,34.29 0 top
R10  13.46,1.78 0 top
R12  7.75,4.45 0 top
R17  17.78,1.27 180 top
R18  7.37,20.45 0 top
R19  44.96,38.99 0 top
R20  51.82,33.27 180 top
R21  22.43,20.14 0 top
R22  26.16,22.23 0 top
RX  7.62,6.1 0 top
S1  30.48,2.54 0 top
TX  9.27,2.54 0 top
U1  16.89,18.92 0 top
U2  15.24,8.89 90 top
U3  16.51,30.48 0 top
U4  46.99,19.05 0 top
U7  46.99,33.02 270 top
U8  27.94,17.78 0 top
U$1  [TR_MINI]  19.83,28.31 0 bottom
Y2  44.96,6.86 180 top

### Tracks (layer width: path | path; a pad name or v marks a point on that pad's centre or on a via)
5V'
  Top 0.508: L2.1 29.23,32.75 27.94,32.75 25.4,32.75
  Top 0.61: U3.4 22.42,32.75 25.4,32.75 27.62,32.75 | C1.1 32.84,38 36.09,38 36.09,32.52 L2.1 | U1.4 19.73,24.79 27.53,24.79 28.12,25.38 28.12,29.06 28.21,29.15 28.21,32.49 27.94,32.75
12V  (via drill 0.55, 0.65)
  Top 0.254: U7.10 46.66,30.38 v46.15,29.87 46.59,29.43 46.83,29.43 47.37,28.89 47.37,28.6
  Top 0.406: U8.10 29.85,17.45 30.84,17.45 31.58,18.19 32.87,18.19 33.87,17.18 C25.1 | 47.37,28.6 C22.1 | v41.25,41.81 42.2,42.76 C20.1 43.43,42.76 C23.1
  Top 0.61: 43.43,42.76 42.78,43.41 9.89,43.41 D2.A | 14.1,24.13 v14.1,20.57 | v22.86,12.7 35.74,12.7 v36.93,13.89 | C25.1 34.04,16.85 v34.04,15.7
  Top 0.813: J6.2 4.71,34.16 | J7.3 4.71,25.03 4.71,34.16 | 6.48,39.2 6.48,24.13 14.1,24.13 | 6.48,39.2 7.77,40.49 7.77,41.29 D2.A | 4.71,34.16 4.71,34.64 4.82,34.75 4.82,37.55 5.86,38.59 5.97,38.7 6.48,39.2
  Bottom 0.406: v46.15,29.87 46.08,29.87 44.8,31.14 44.8,36.12 44.37,36.55 42.8,36.55 41.25,38.1 v41.25,41.81
  Bottom 0.61: v22.86,12.7 21.97,12.7 v14.1,20.57 | v36.93,13.89 35.89,13.89 34.09,15.7 v34.04,15.7
ADC_OUT1  (via drill 0.55)
  Top 0.254: 46.49,23.86 U4.89
  Top 0.305: v46.59,23.76 46.49,23.86
  Bottom 0.254: 48.49,31.77 48.49,30.95 48.9,30.55 48.9,27.82 48.49,27.42
  Bottom 0.305: 48.49,31.77 52.07,35.34 J3.3 | v46.59,23.76 46.59,25.78 46.85,25.78 48.49,27.42
ADC_OUT2  (via drill 0.55)
  Top 0.254: v47.7,24.97 46.99,25.68 U4.88
  Bottom 0.254: 49.05,31.34 49.05,31.04 49.35,30.73 49.35,26.62 v47.7,24.97
  Bottom 0.305: 49.05,31.34 54.61,36.91 J3.5
DIGI_OUT1
  Top 0.254: J3.2 49.67,41.91 51.22,43.46 52.84,43.46 53.34,42.96 53.34,42.86 53.34,41.38 54.08,40.64 55.46,40.64 55.88,40.22 55.88,38.84 56.62,38.1 56.66,38.1 56.84,37.91 | 56.84,29.23 56.82,29.21 53.92,29.21 52.49,27.78 U4.77
  Top 0.305: 56.84,37.91 56.84,29.23
DIGI_OUT2
  Top 0.254: J3.4 53.34,40.64 53.34,37.74 53.37,37.71 | U4.78 52.02,26.83 52.02,28.54 53.3,29.82
  Top 0.305: 53.3,29.82 56.26,29.82 56.26,34.82 53.37,37.71
DIGI_OUT3
  Top 0.254: 55.93,24.16 55.93,24.2 55.58,24.55 U4.74
  Top 0.305: J4.4 56.66,20.95 55.93,21.68 55.93,24.16
DIGI_OUT4
  Top 0.254: U4.75 55.98,25.05 56.01,25.02
  Top 0.305: J4.3 57.53,23.5 56.01,25.02
DIGI_OUT5
  Top 0.254: J4.2 57.12,26.95 53.34,26.95 53.19,26.8 U4.76
GND  (via drill 0.51, 0.55)
  Top 0.254: U2.21 11.53,9.13 10.78,9.13 10.21,9.7 10.21,10.53 10.92,11.24 11.54,11.24 U2.18 | U4.32 44,11.32 44,12.16 44.21,12.37 44.93,12.37 v45.44,12.88
  Top 0.305: U7.17 47.31,32.7 U7.11 | U8.17 28.27,18.11 U8.11
  other vias: 11.76,3.63 31.01,19.23 35.36,19.94 31.32,22.28 30.35,24.28 37.74,21.97 37.29,24.23 35.79,25.7 37.69,19.51 34.29,36.58 35.46,17.25 37.74,12.6 37.92,35.79 41.38,28.3 37.69,30.63 9.27,15.88 45.85,3.3 50.55,3.43 26.54,5.21 47.9,29.9 39.98,3.81 40.11,35.94 46.23,20.07 48.23,20.55
  pour Top (rank 2): -3.81,48.26 -3.81,-3.81 63.5,-3.81 63.5,48.26
  pour Bottom (rank 2): -6.35,49.53 -6.35,-6.35 67.31,-6.35 67.31,49.53
MISO  (via drill 0.55)
  Top 0.254: U4.22 39.27,14.52 40.12,14.52 40.62,14.02 40.76,14.02
  Top 0.305: 40.76,14.02 v40.74,14.01
  Bottom 0.254: 45.43,14.39 44.3,15.52 42.37,15.52 42.12,15.27 42.12,14.94 41.56,14.39 41.12,14.39
  Bottom 0.305: 41.12,14.39 v40.74,14.01 | J5.2 51.31,8.51 45.43,14.39
MOSI  (via drill 0.55)
  Top 0.254: U4.21 39.27,15.08 40.57,15.08 40.79,15.3 v41.26,15.3
  Bottom 0.254: 54,9.12 54,9.06 53.98,9.04 53.98,7 54,6.98
  Bottom 0.305: J5.3 54.99,5.97 54.99,5.99 54,6.98 | v41.26,15.3 42.02,16.06 44.64,16.06 50.65,10.05 53.07,10.05 54,9.12
MOTOR1_CLOSE  (via drill 0.55)
  Top 0.254: U4.6 40.9,22.55 v41.25,22.2
  Top 0.305: U7.13 49.67,31.27 v50.32,31.27
  Bottom 0.305: v50.32,31.27 49.84,30.79 49.84,25.45 46.58,22.2 v41.25,22.2
MOTOR1_OPEN  (via drill 0.55)
  Top 0.254: v40.8,20.08 40.8,21.34 40.09,22.05 U4.7
  Top 0.305: U7.14 48.93,32.65 49.72,32.65 50.22,32.16 51.56,32.16 v51.84,31.88
  Bottom 0.305: v51.84,31.88 51.84,31.52 50.42,30.1 50.42,25.16 46.8,21.54 42.26,21.54 v40.8,20.08
MOTOR1_SENSE  (via drill 0.55)
  Top 0.254: 42.49,28.96 U4.97
  Top 0.305: 42.49,28.96 40.44,31.01 39.24,31.01 v39.14,30.91
  Bottom 0.305: MOTOR1.1 39.14,40.95 v39.14,30.91
MOTOR2_CLOSE  (via drill 0.55)
  Top 0.254: U4.5 40.61,23.05 40.61,23.06 40.86,23.06 v41.27,23.47
  Top 0.305: U7.8 43.81,30.77 v43.81,30.2
  Bottom 0.305: v43.81,30.2 43.81,29.9 45.59,28.12 45.59,23.42 41.33,23.42 v41.27,23.47
MOTOR2_OPEN  (via drill 0.55)
  Top 0.305: U7.7 44.38,32.7 43.26,31.57 v42.98,31.57 | v39.75,28.19 38.25,26.7 38.25,26.04 U4.1
  Bottom 0.305: v39.75,28.19 40.16,28.19 40.16,29.18 40.23,29.26 41.28,29.26 42.98,30.96 v42.98,31.57
MOTOR2_SENSE  (via drill 0.55)
  Top 0.254: 42.99,29.78 U4.96
  Top 0.305: v35.05,28.91 35.05,29.36 37.62,31.93 40.84,31.93 42.99,29.78
  Bottom 0.305: v35.05,28.91 34.59,28.91 33.53,29.97 MOTOR2.1
MOTOR3_CLOSE
  Top 0.254: U4.16 37.57,17.55 36.22,18.9 36.22,20.26 35.86,20.62 35.7,20.78 35.63,20.85 34.29,20.85
  Top 0.305: U8.13 30.09,20.85 34.29,20.85
MOTOR3_OPEN
  Top 0.254: U4.15 37.9,18.05 36.83,19.12 36.83,20.29 36.68,20.45 35.74,21.39
  Top 0.305: U8.14 28.27,20.64 29.01,21.39 35.74,21.39
MOTOR3_SENSE  (via drill 0.55)
  Top 0.254: U4.95 43.52,26.77 43.52,20.36
  Top 0.305: v43.56,20.32 43.52,20.36
  Bottom 0.305: MOTOR3.1 32.08,18.14 41.38,18.14 v43.56,20.32
MOTOR4_CLOSE
  Top 0.254: 37.5,17.05 U4.17
  Top 0.305: U8.8 30.34,14.46 34.91,14.46 37.5,17.05
MOTOR4_OPEN
  Top 0.305: U8.7 28.27,15.04 29.62,13.69 35.15,13.69 38.01,16.55 U4.18
MOTOR4_SENSE  (via drill 0.55)
  Top 0.254: U4.94 44.02,26.77 44.02,25.92 44.62,25.32 44.62,14.58 44.55,14.5
  Top 0.305: 44.55,14.5 v43.66,14.5
  Bottom 0.305: MOTOR4.1 31.98,6.99 37.16,6.99 43.66,13.49 v43.66,14.5
MUSCLE_SENSE  (via drill 0.55)
  Top 0.254: U4.91 45.49,27.68 45.26,27.91 44.15,27.91 44.09,27.86 44.04,27.86 43.97,27.94 v43.97,28.42
  Top 0.305: v10.29,22.23 8.93,22.23 R1.2
  Bottom 0.305: v43.97,28.42 38.81,23.27 23.77,23.27 22.61,22.1 10.41,22.1 v10.29,22.23
N$1
  Top 0.813: D2.C 10.29,38.11 C12.1 12.82,39.12 16.51,35.43 16.51,27.05 21.82,27.05 U3.1
N$2  (via drill 0.55)
  Top 0.305: v7.98,10.69 7.29,10.69 5.99,9.39 5.08,9.39 4.84,9.39 J2.3 | v9.07,13.3 9.25,13.12 U2.15
  Bottom 0.305: v7.98,10.69 9.07,11.79 v9.07,13.3
N$4
  Top 0.305: U2.16 11.54,12.39 7.94,12.39 5.6,10.05 J2.2
N$5
  Top 0.305: U2.1 18.9,4.7 R5.1
N$6
  Top 0.305: U2.5 18.88,7.28 19.74,7.28 21.6,9.14 R6.1
N$7
  Top 0.305: U2.17 11.56,11.87 10.87,11.87 9.23,10.24 C6.1
N$9
  Top 0.305: U2.23 11.6,7.9 10.76,7.9 9.64,6.78 9.64,3.05 TX.C
N$10
  Top 0.305: U2.22 11.61,8.57 10.64,8.57 10.14,8.08 8.5,8.08 RX.C
N$11
  Top 0.305: J7.2 4.99,22.77 6.35,22.77 6.68,22.77 | 6.74,22.77 6.68,22.77 | 6.68,22.77 R1.1
N$12
  Top 0.305: TX.A 9.26,1.68 12.51,1.68 R10.1
N$13
  Top 0.305: RX.A 6.9,5.94 R12.1
N$14
  Top 0.305: U2.2 20.72,5.32 C7.1
N$15
  Top 0.305: U8.4 25.11,15.88 R7.2
N$16
  Top 0.305: R8.2 43.31,34.79 45.89,34.79 U7.4
N$18
  Top 0.61: L2.2 22.28,29.21 U3.2 21.8,28.83 18.92,28.83 18.8,28.96 18.8,35.81 19.81,36.83 CR1.1
N$40
  Top 0.305: R18.2 6.74,18.97 ON.C
N$41
  Top 0.254: U4.33 44.46,11.27 44.46,8.9 Y2.2
  Top 0.305: Y2.2 42.46,6.82 C18.1
N$42
  Top 0.254: U4.34 45.02,11.27 45.02,8.85 47.02,6.86 Y2.1
  Top 0.305: C19.1 47.41,6.77 Y2.1
N$43
  Top 0.305: U7.9 45.02,31.12 44.74,30.83 44.74,30 C22.2
N$44
  Top 0.305: U7.1 47.97,36.88 R19.2
N$45
  Top 0.305: C21.1 52.47,30.58 51.44,30.58 50.75,29.9 49.19,29.9 U7.12
N$46  (via drill 0.55)
  Top 0.305: v38.05,33.91 39.42,32.54 43,32.54 43.94,33.48 43.94,33.91 44.03,33.99 U7.5
  Bottom 0.305: MOTOR2.3 35.64,27.96 36.65,28.98 36.65,32.51 v38.05,33.91
N$47  (via drill 0.55)
  Top 0.305: v37.95,37.47 46.5,37.47 47.31,36.65 U7.2
  Bottom 0.305: MOTOR1.4 37.47,37.95 v37.95,37.47
N$48  (via drill 0.55)
  Top 0.305: U7.3 46.66,35.68 46.41,35.94 42.19,35.94 v42.19,35.76
  Bottom 0.305: MOTOR2.4 35.74,26.98 38.73,29.97 41.27,29.97 41.27,34.85 v42.19,35.76
N$49  (via drill 0.55)
  Top 0.305: v42.52,38.91 37.97,38.91 v37.85,39.04 | v50.11,35.1 50.11,34.49 49.62,33.99 U7.16
  Bottom 0.305: v37.85,39.04 37.44,38.63 31.88,38.63 MOTOR1.3 | v42.52,38.91 46.56,38.91 50.11,35.36 v50.11,35.1
N$50
  Top 0.305: U7.15 50.9,33.34 R20.2
N$51
  Top 0.305: U8.9 31.96,16.8 C25.2
N$52
  Top 0.305: R21.2 24.65,20.14 U8.1
N$53
  Top 0.305: U8.12 29.84,19.49 30.54,20.19 31.41,20.19 C24.1
N$54  (via drill 0.55)
  Top 0.305: v27.05,14.48 26.96,14.56 U8.5
  Bottom 0.305: MOTOR4.3 30.98,4.83 27.05,8.75 v27.05,14.48
N$55  (via drill 0.55)
  Top 0.305: v21.84,18.43 23.75,18.43 23.98,18.21 25.94,18.21 U8.2
  Bottom 0.305: MOTOR3.4 31,14.88 27.85,18.03 25.1,18.03 24.69,18.44 v21.85,18.44 v21.84,18.43
N$56  (via drill 0.55)
  Top 0.305: v24.28,17.02 24.28,17.45 U8.3
  Bottom 0.305: MOTOR4.4 31.8,3.86 30.47,3.86 24.28,10.05 v24.28,17.02
N$57  (via drill 0.55)
  Top 0.305: v26.29,20.85 26.29,20.36 U8.16
  Bottom 0.305: MOTOR3.3 31.8,15.9 30.98,15.9 28.33,18.54 26.29,18.54 v26.29,20.85
N$58
  Top 0.305: U8.15 27.61,21.62 R22.2
PWM_OUT  (via drill 0.55)
  Top 0.305: v47.14,16.2 46.99,16.05 U4.38
  Bottom 0.305: J8.1 57.28,11.81 51.36,11.81 47.14,16.03 v47.14,16.2
PWM_OUT2  (via drill 0.55)
  Top 0.254: 48.28,13.97 47.49,13.18 U4.39
  Top 0.305: v48.87,17.96 48.28,17.37 48.28,13.97
  Bottom 0.305: v48.87,17.96 48.87,15.7 50.98,13.59 J8.2
PWM_OUT3  (via drill 0.55)
  Top 0.305: v50.42,16.1 49.01,14.69 49.01,13.28 47.99,12.27 U4.40
  Bottom 0.305: J8.3 50.44,16.13 v50.42,16.1
RESET  (via drill 0.55)
  Top 0.254: J5.6 57.78,8.26 56.52,6.99 56.52,4.72 56.13,4.34 54.69,4.34 54.48,4.14 54.48,3.41 52.72,1.65 40.01,1.65 39.12,2.54 S1.2 37.08,4.54 37.08,6.48 40.56,9.96 42.53,9.96 42.74,10.16 42.99,10.41 U4.30
  Top 0.305: 22.44,1.69 C2.2 | v20.7,6.73 20.7,6.9 21.97,8.17 23.32,8.17 24.09,7.4 C7.2
  Top 0.406: 22.44,1.69 v21.08,3.05 20.41,3.05 R17.1 | C2.2 33.81,1.27 S1.2
  Bottom 0.305: v20.7,6.73 20.7,6.6 20.45,6.35
  Bottom 0.406: 20.45,6.35 20.45,3.68 v21.08,3.05
RX_OUT  (via drill 0.55)
  Top 0.254: U4.45 50.52,11.33 50.52,12.32 51.02,12.83 51.59,12.83 51.79,13.03 51.79,17.04 v51.64,17.2
  Bottom 0.254: 55.85,38.46 55.85,38.82 55.88,38.84 55.88,40.64 J3.6
  Bottom 0.305: 55.85,38.46 55.85,27.79 50.11,22.05 50.11,18.72 v51.64,17.2
RXD
  Top 0.254: U4.2 40.25,24.55 40.95,25.25 42.32,25.25 42.67,24.89 42.67,24.8
  Top 0.305: 42.67,24.8 42.67,13.84 41.27,12.45 40.74,12.45 40.26,11.96 40.26,10.92 38.23,8.89 27.81,8.89 25.27,6.35 25.27,4.7 R5.2
SCK  (via drill 0.55)
  Top 0.254: v41.07,17.04 40.31,16.28 40.31,15.77 40.09,15.55 U4.20
  Bottom 0.305: v41.07,17.04 44.42,17.04 50.56,10.91 53.1,10.91 55.24,8.76 J5.4
TX_OUT  (via drill 0.55)
  Top 0.254: U4.46 50.99,12.15 51.21,12.37 52.02,12.37 52.98,13.34 v52.98,17.27
  Bottom 0.305: J3.8 57.15,41.38 58.57,39.96 58.57,31.01 56.69,29.13 56.69,27.98 56.62,27.9 56.62,27.66 51.31,22.35 51.31,18.95 v52.98,17.27
TXD
  Top 0.254: U4.3 40.39,24.05 41.13,24.79 42.06,24.79 42.16,24.69 42.16,23.37
  Top 0.305: 42.16,23.37 42.16,14.07 41.12,13.03 40.6,13.03 39.5,11.92 39.5,10.93 38.04,9.47 27.62,9.47 27.29,9.14 R6.2
VBUS
  Top 0.305: J2.1 4.83,10.7 6.99,12.86
  Top 0.406: F1.1 10.38,14.61 7.99,14.61 6.99,13.61 6.99,12.86
VCC  (via drill 0.55)
  Top 0.254: v39.12,5.97 39.28,5.97 43.49,10.18 U4.31 43.49,12.3 45.08,13.89 45.08,16.38 47.99,19.29 50.29,19.29 | U4.10 37.44,20.55 36.47,21.51 36.47,22.29 35.73,23.03 34.97,23.03 34.72,23.28 | 40.18,26.8 U4.100 | 53.67,18.16 53.78,18.05 U4.61
  Top 0.305: v51.87,29.67 51.41,29.67 50.99,29.25 U4.80 50.99,20.99 52.69,19.29 52.54,19.29 | J4.1 57.76,28.3 v54.28,28.3 | 52.54,19.29 53.67,18.16 | 50.29,19.29 52.54,19.29
  Top 0.406: R12.2 6.86,2.71 6.86,1.22 7.29,0.79 13.32,0.79 R10.2 14.31,5.02 15.91,6.62 | U2.20 12.87,9.87 15.18,7.56 15.37,7.37 15.37,6.73 15.48,6.62 15.91,6.62 | 15.91,6.62 16.51,6.62 | 16.51,6.62 U2.4 | 16.51,6.62 16.93,6.2 16.93,2.54 | 16.93,2.54 R17.2 | ON.A 10.03,18.54 10.03,18.8 10.03,19.9 C8.1 | J3.1 49.53,37.25 52.67,34.11 R20.1 53.05,32.89 v53.98,32.89 | 20.36,22.23 R22.1 | 34.72,23.28 37.26,25.82 v37.26,26.87 | v39.93,26.54 40.18,26.8 | v29.23,25.6 29.23,23.44 29.23,23.21 29.23,22.91 v28.6,22.28 | 29.31,23.21 29.31,23.28 | v18.41,2.67 18.29,2.54 16.93,2.54
  Top 0.508: R22.1 25.31,22.84 25.91,23.44 29.23,23.44 | 29.23,23.21 29.31,23.21 | 29.31,23.28 34.72,23.28 | 15.18,7.56 15.18,11.88 U1.3 19.19,18.8 19.19,21.05 20.36,22.23
  Top 0.61: 19.19,18.8 10.03,18.8
  Bottom 0.305: v51.87,29.67 52.91,29.67 v54.28,28.3
  Bottom 0.406: v37.26,26.87 37.59,26.54 v39.93,26.54 | v53.98,32.89 54.28,32.59 v54.28,28.3 | v29.23,25.6 29.23,27.96 | 29.23,27.96 28.4,27.13 28.4,36.83 28.4,37.8 | 29.23,27.96 30.23,28.96 MOTOR2.2 | 30.25,39.93 MOTOR1.2 | MOTOR3.2 31.77,16.82 30.93,16.82 29.23,18.51 29.23,21.64 v28.6,22.28 | MOTOR4.2 38.96,5.82 v39.12,5.97 | v39.12,5.97 40.88,5.97 41.32,5.52 52.26,5.52 J5.1 | v39.12,5.97 36.74,3.59 36.74,1.15 36.48,0.89 20.07,0.89 18.41,2.54 v18.41,2.67
  Bottom 0.508: 28.4,36.83 28.4,38.08 30.25,39.93
VUSB
  Top 0.406: C4.+ 7.67,16.05 9.53,17.91 11.94,17.91 12.41,17.44 R3.1
  Top 0.61: F1.2 12.41,15.04 R3.1 13.15,15.9 U1.1